# Altium schematic sheet ToneDroneOsc.SchDoc
size A; SheetNumber: 2; SheetTotal: 5
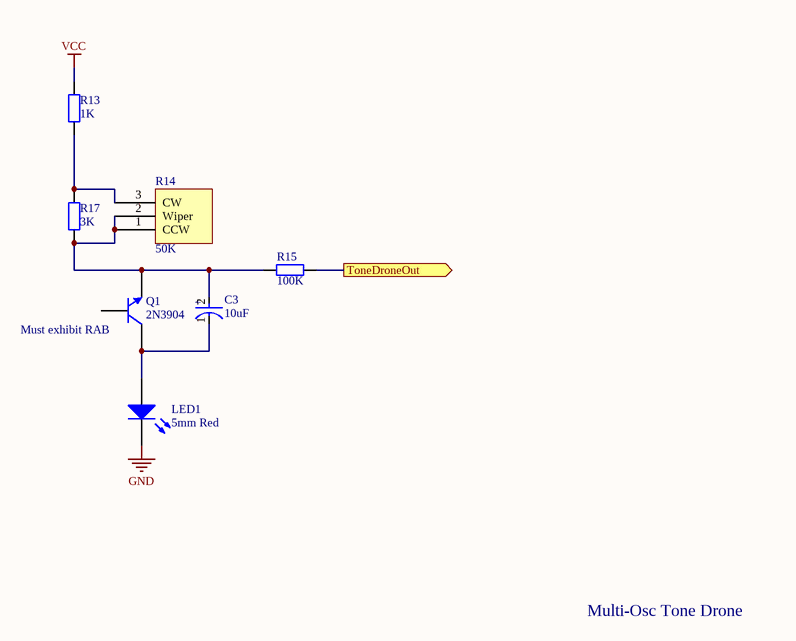
[diagram p0: ToneDroneOsc.SchDoc]

## Parts
C3  10uF  [FP-ESLE3-MFG]
LED1  5mm Red  [Type 5mm]
Q1  2N3904  [TO-92A]
R13  1K  [AXIAL-0.4]
R14  50K  [TrimmerPot]
R15  100K  [AXIAL-0.4]
R17  3K  [AXIAL-0.4]

## Ports
ToneDroneOut (out)

## Nets
GND: LED1.1(K)
VCC: R13.2
ToneDroneOut: R15.1 ; port ToneDroneOut
NetC3_1: C3.1(C) LED1.2(A) Q1.3(C)
NetC3_2: C3.2(A) Q1.1(E) R14.1(CCW) R14.2(Wiper) R15.2 R17.1
NetR13_1: R13.1 R14.3(CW) R17.2

Not connected (* = marked no-connect by the designer): Q1 2(B)

## Notes on the sheet
- (near Q1) Must exhibit RAB
- Multi-Osc Tone Drone
- (in symbol CMP-03015-000004-1) +

## Library data of the parts
C3 = CMP-03015-000004-1: CAP ALUM 10UF 20% 100V THRU HOLE; Manufacturer Part Number: ESL106M100AE3AA; Manufacturer: kemet; Life: 10000Hours; Ripple Current: 280mA; Dissipation Factor: 9%; Esr: 0.68Ω; Leakage Current: 10uA; Material: Aluminum; Tolerance: 20%; Voltage Rating: 100V; Device Class L3: Aluminum Electrolytic Capacitors; Value: 10uF; Height: 12.5mm; Temperature Range High: +105°C; Capacitance: 10uF; ComponentLink2Description: Datasheet; Mouser Description: Cap, 10UF, 100V, Alu Elec, Radial; Category: Cap; Octopart: https://octopart.com/esl106m100ae3aa-kemet-84758885; Temperature: -40°C to +105°C; RoHS: TRUE; Device Class L1: Passive Components; Digikey Description: CAP ALUM 10UF 20% 100V THRU HOLE; ComponentLink2URL: https://content.kemet.com/datasheets/KEM_A4074_ESL.pdf; Device Class L2: Capacitors; Temperature Range Low: -40°C; Package: ESLE3; Automotive: No; Lead Free: Yes
LED1 = CMP-1488-00008-1: THT LED round mono-color color lens, WL-TMRW, Red; PartNumber: 151051RS11000; Manufacturer: Wuerth Elektronik; PackageReference: Type 5mm; ComponentLink2URL: http://katalog.we-online.de/pbs/datasheet/7448042001.pdfhttp://katalog.we-online.de/pbs/datasheet/7448042001.pdfhttp://katalog.we-online.de/pbs/datasheet/7448042001.pdfhttp://katalog.we-online.de/pbs/datasheet/151051RS11000.pdf; ComponentLink1URL: http://www.we-online.com; ComponentLink1Description: Manufacturer URL; ComponentLink2Description: Datasheet; Emitting color: Red
Q1 = 2N3904: NPN General Purpose Amplifier; Published: 8-Jun-2000; LatestRevisionDate: 15-Jan-2003; LatestRevisionNote: PCB Footprint 'BCY-W3/D4.7' replaced; DatasheetVersion: 1997; PackageVersion: Sep-1998; PackageReference: TO-92A; Publisher: Altium Limited; PackageDescription: TO, Flat Index; 3 In-Line, Axial Leads; Body Dia. 4.5mm; Leads 0.51 x 0.48 mm (max); ComponentLink1Description: Manufacturer Link; ComponentLink1URL: http://www.fairchildsemi.com/; ComponentLink2Description: Datasheet; ComponentLink2URL: http://www.fairchildsemi.com/ds/2N%2F2N3904.pdf
R13 R15 = Res2: Resistor; Published: 8-Jun-2000; LatestRevisionDate: 17-Jul-2002; LatestRevisionNote: Re-released for DXP Platform.; PackageReference: AXIAL-0.4; Publisher: Altium Limited; PackageDescription: Axial Device, Thru-Hole; 2 Leads; 0.4 in Pin Spacing
  R13: Value: 1K
  R15: Value: 100K
R14 = TrimmerPot
R17 = Res2: Resistor; Value: 1K; Published: 8-Jun-2000; LatestRevisionDate: 17-Jul-2002; LatestRevisionNote: Re-released for DXP Platform.; PackageReference: AXIAL-0.4; Publisher: Altium Limited; PackageDescription: Axial Device, Thru-Hole; 2 Leads; 0.4 in Pin Spacing